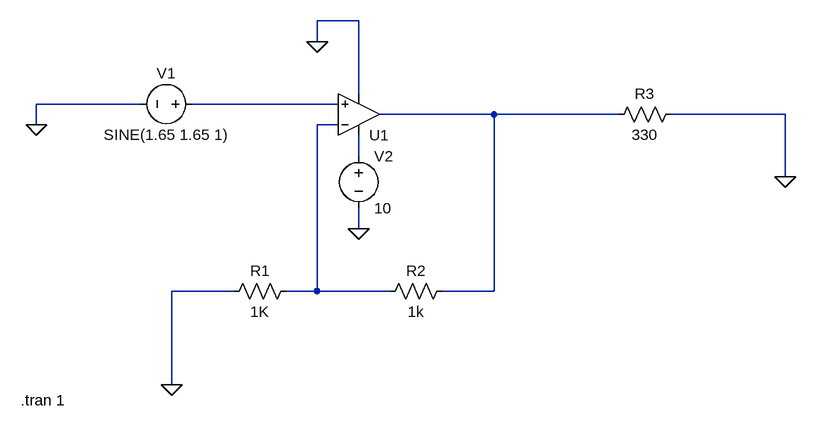
[diagram p0: schematic OP_AMP.asc]
OP_AMP.asc, the LTspice schematic file:
Version 4
SHEET 1 1220 680
WIRE 544 -48 480 -48
WIRE 480 -16 480 -48
WIRE 544 64 544 -48
WIRE 208 80 48 80
WIRE 512 80 288 80
WIRE 752 96 576 96
WIRE 944 96 752 96
WIRE 1200 96 1024 96
WIRE 48 112 48 80
WIRE 512 112 480 112
WIRE 544 160 544 128
WIRE 1200 192 1200 96
WIRE 544 272 544 240
WIRE 352 368 256 368
WIRE 480 368 480 112
WIRE 480 368 432 368
WIRE 592 368 480 368
WIRE 752 368 752 96
WIRE 752 368 672 368
WIRE 256 512 256 368
FLAG 256 512 0
FLAG 48 112 0
FLAG 480 -16 0
FLAG 544 272 0
FLAG 1200 192 0
SYMBOL voltage 304 80 R90
WINDOW 0 -32 56 VBottom 2
WINDOW 3 32 56 VTop 2
WINDOW 123 0 0 Left 0
WINDOW 39 0 0 Left 0
SYMATTR InstName V1
SYMATTR Value SINE(1.65 1.65 1)
SYMBOL OpAmps\\UniversalOpAmp 544 96 M180
SYMATTR InstName U1
SYMBOL res 448 352 R90
WINDOW 0 0 56 VBottom 2
WINDOW 3 32 56 VTop 2
SYMATTR InstName R1
SYMATTR Value 1K
SYMBOL res 688 352 R90
WINDOW 0 0 56 VBottom 2
WINDOW 3 32 56 VTop 2
SYMATTR InstName R2
SYMATTR Value 1k
SYMBOL voltage 544 144 R0
WINDOW 123 0 0 Left 0
WINDOW 39 0 0 Left 0
SYMATTR InstName V2
SYMATTR Value 10
SYMBOL res 1040 80 R90
WINDOW 0 0 56 VBottom 2
WINDOW 3 32 56 VTop 2
SYMATTR InstName R3
SYMATTR Value 330
TEXT 24 536 Left 2 !.tran 1

The netlist it stands for:
* OP_AMP.asc
V1 N001 0 SINE(1.65 1.65 1)
XU1 N001 N003 N004 0 N002 level1 Avol=1Meg GBW=10Meg Vos=0 En=0 Enk=0 In=0 Ink=0 Rin=500Meg  ; pins In+ In- V+ V- OUT
R1 N003 0 1K
R2 N002 N003 1k
V2 N004 0 10
R3 0 N002 330
.tran 1
.lib UniversalOpAmp1.lib
.backanno
.end